# Altium schematic sheet LED-Board.SchDoc
size A4
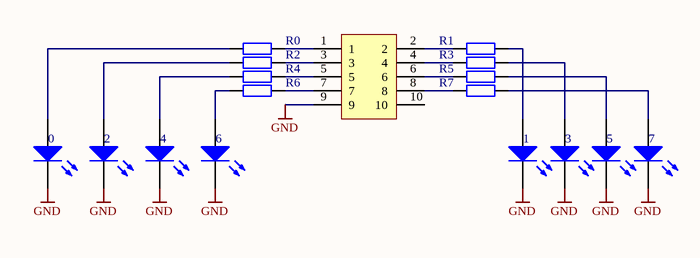
[diagram p0: LED-Board.SchDoc]

## Parts
0  (no value)  [6-0805_M]
1  (no value)  [6-0805_M]
2  (no value)  [6-0805_M]
3  (no value)  [6-0805_M]
4  (no value)  [6-0805_M]
5  (no value)  [6-0805_M]
6  (no value)  [6-0805_M]
7  (no value)  [6-0805_M]
?  10 pol Header  [10 pol Header]  (value not drawn)
R0  Res2  [6-0805_M]  (value not drawn)
R1  Res2  [6-0805_M]  (value not drawn)
R2  Res2  [6-0805_M]  (value not drawn)
R3  Res2  [6-0805_M]  (value not drawn)
R4  Res2  [6-0805_M]  (value not drawn)
R5  Res2  [6-0805_M]  (value not drawn)
R6  Res2  [6-0805_M]  (value not drawn)
R7  Res2  [6-0805_M]  (value not drawn)

## Nets
GND: 0.2(K) 1.2(K) 2.2(K) 3.2(K) 4.2(K) 5.2(K) 6.2(K) 7.2(K) ?.9
Net0_1: 0.1(A) R0.2
Net1_1: 1.1(A) R1.1
Net2_1: 2.1(A) R2.2
Net3_1: 3.1(A) R3.1
Net4_1: 4.1(A) R4.2
Net5_1: 5.1(A) R5.1
Net6_1: 6.1(A) R6.2
Net7_1: 7.1(A) R7.1
Net?_1: ?.1 R0.1
Net?_2: ?.2 R1.2
Net?_3: ?.3 R2.1
Net?_4: ?.4 R3.2
Net?_5: ?.5 R4.1
Net?_6: ?.6 R5.2
Net?_7: ?.7 R6.1
Net?_8: ?.8 R7.2

Not connected (* = marked no-connect by the designer): ? 10

## Library data of the parts
0-7 = LED3: Typical BLUE SiC LED; Published: 8-Jun-2000; LatestRevisionDate: 17-Dec-2003; LatestRevisionNote: PCB Footprint replaced.; DatasheetVersion: 16-Apr-2002; PackageVersion: 16-Apr-2002; PackageReference: 3.5X2.8X1.9; Publisher: Altium Limited; PackageDescription: SM LED; 2 C-Bend Leads; Body 3.5 x 2.8 x 1.9 mm, inc leads (LxWxH typ)
R0-R7 = Res2: Resistor; Published: 8-Jun-2000; LatestRevisionDate: 17-Jul-2002; LatestRevisionNote: Re-released for DXP Platform.; PackageReference: AXIAL-0.4; Publisher: Altium Limited; PackageDescription: Axial Device, Thru-Hole; 2 Leads; 0.4 in Pin Spacing
? = 10 pol Header: LatestRevisionDate: 2012-06-14; Publisher: NONLINEAR LABS